# EAGLE schematic irkit_v02 (EAGLE 6.4)
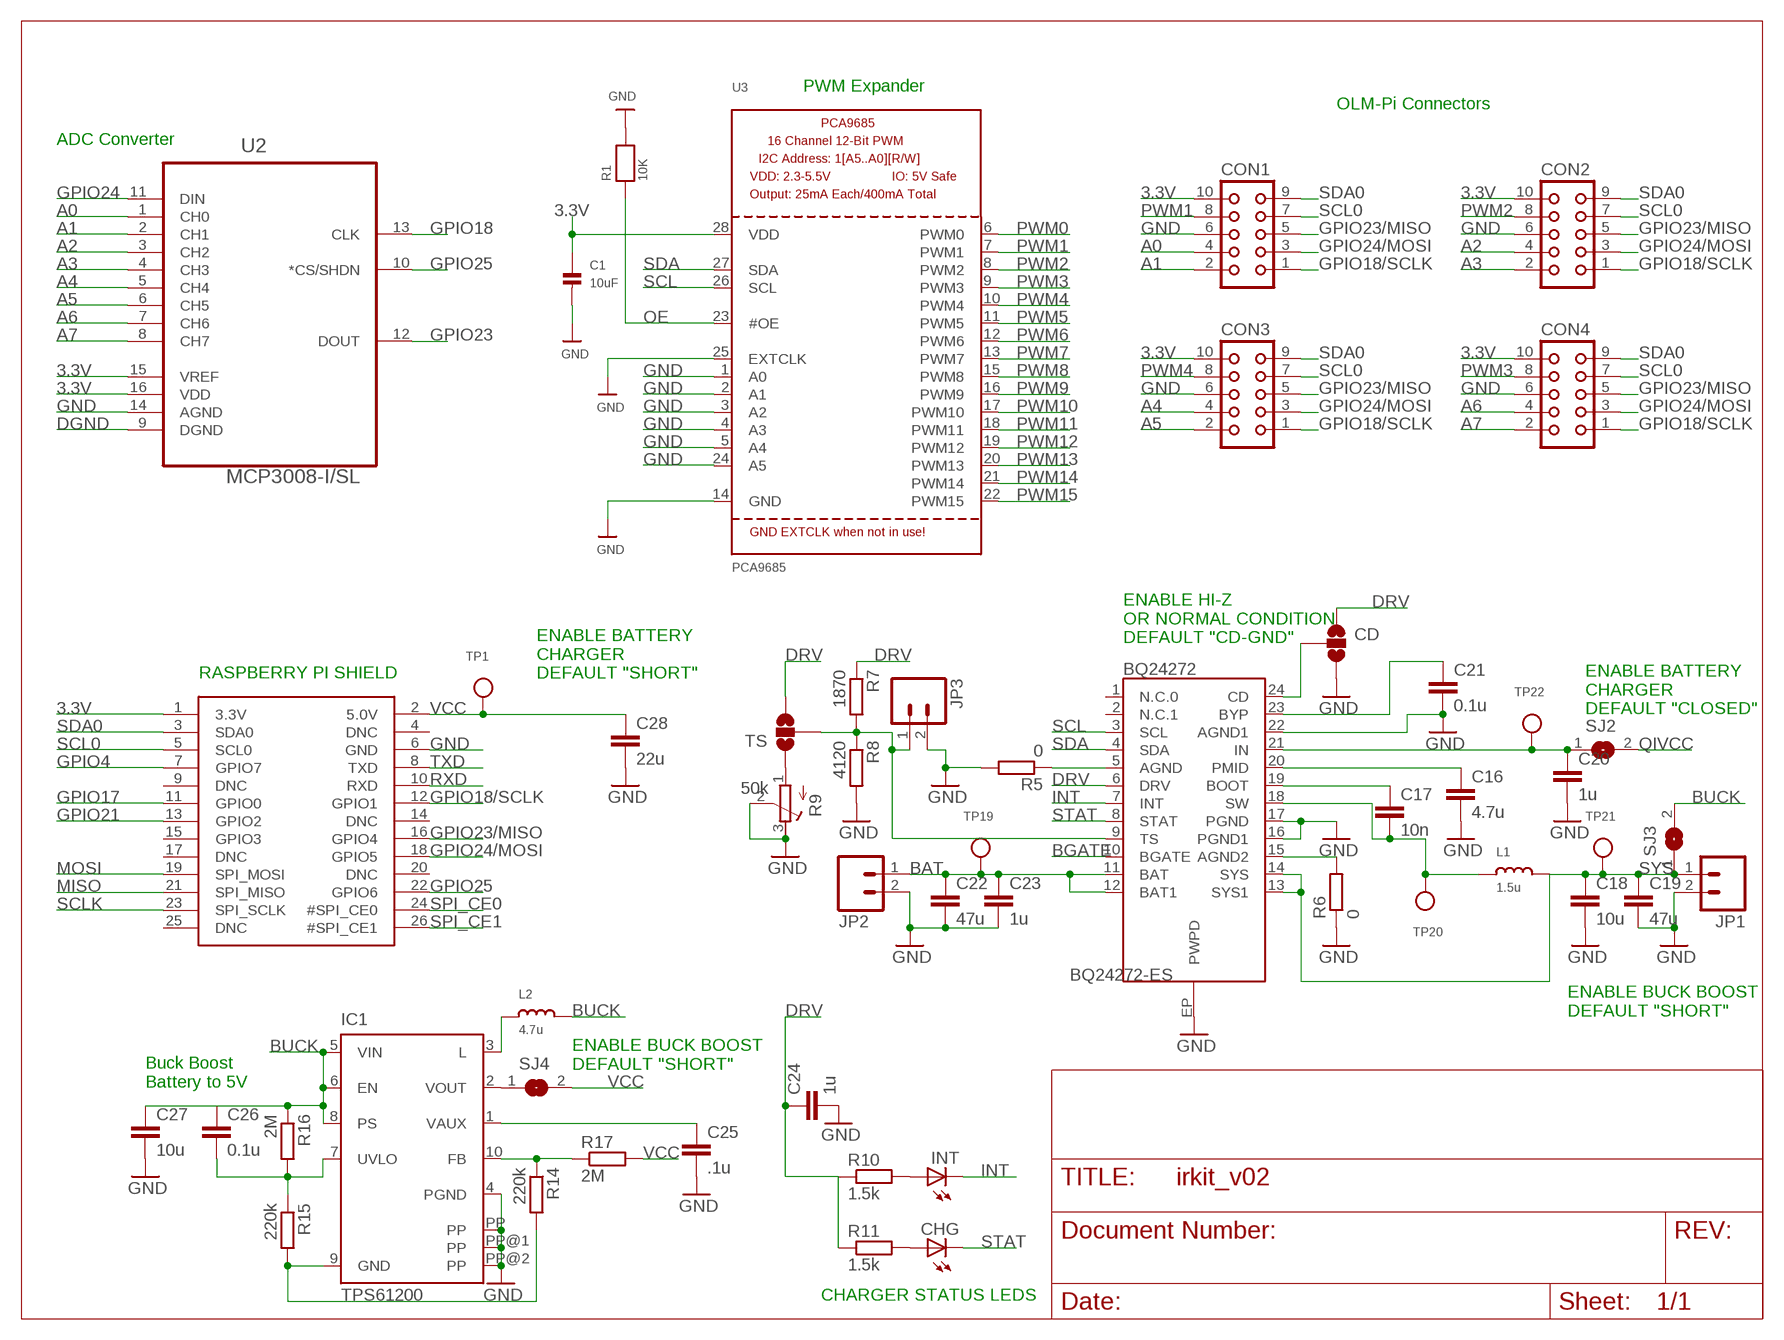
[diagram p0: schematic, sheet 1]

## Parts
BQ24272  BQ24272-ES  [QFN-24_ALT2]
C1  10uF  CAP_CERAMIC0805  [0805]
C16  4.7u  C-EUC0603K  [C0603K]
C17  10n  C-EUC0603K  [C0603K]
C18  10u  C-EUC0603K  [C0603K]
C19  47u  C-EUC0603K  [C0603K]
C20  1u  C-EUC0603K  [C0603K]
C21  0.1u  C-EUC0603K  [C0603K]
C22  47u  C-EUC0603K  [C0603K]
C23  1u  C-EUC0603K  [C0603K]
C24  1u  C-EUC0603K  [C0603K]
C25  .1u  C-EUC0603K  [C0603K]
C26  0.1u  C-EUC0603K  [C0603K]
C27  10u  C-EUC0603K  [C0603K]
C28  22u  C-EUC0603K  [C0603K]
CD  SOLDERJUMPER_2WAYS  [SJ_3]
CHG  LEDCHIP-LED0603  [CHIP-LED0603]
CON1  CON10L  [CON10L]
CON2  CON10L  [CON10L]
CON3  CON10L  [CON10L]
CON4  CON10L  [CON10L]
IC1  TPS61200  [S-PDSO-N10]
INT  LEDCHIP-LED0603  [CHIP-LED0603]
JP1  M02PTH3  [1X02_LONGPADS]
JP2  M02PTH3  [1X02_LONGPADS]
JP3  M02PTH3  [1X02_LONGPADS]
L1  1.5u  INDUCTORNR5040  [INDUCTOR_5X5MM_NR5040_NOTHERMALS]
L2  4.7u  INDUCTORNR5040  [INDUCTOR_5X5MM_NR5040_NOTHERMALS]
R1  10K  RESISTOR0805  [0805]
R5  0  R-EU_R0402  [R0402]
R6  0  R-EU_R0402  [R0402]
R7  1870  R-EU_R0402  [R0402]
R8  4120  R-EU_R0402  [R0402]
R9  50k  R-TRIMM64Y  [RTRIM64Y]
R10  1.5k  R-EU_R0402  [R0402]
R11  1.5k  R-EU_R0402  [R0402]
R14  220k  R-EU_R0402  [R0402]
R15  220k  R-EU_R0402  [R0402]
R16  2M  R-EU_R0402  [R0402]
R17  2M  R-EU_R0402  [R0402]
SJ2  SJ  [SJ]
SJ3  SJ  [SJ]
SJ4  SJ  [SJ]
TP1  TESTPOINTROUND1MM  [TESTPOINT_ROUND_1MM]
TP19  TESTPOINTROUND1MM  [TESTPOINT_ROUND_1MM]
TP20  TESTPOINTROUND1MM  [TESTPOINT_ROUND_1MM]
TP21  TESTPOINTROUND1MM  [TESTPOINT_ROUND_1MM]
TP22  TESTPOINTROUND1MM  [TESTPOINT_ROUND_1MM]
TS  SOLDERJUMPER_2WAYS  [SJ_3]
U2  MCP3008-I/SL  [SOIC127P600X175-16N]
U3  PCA9685  [TSSOP28]
U$1  RASPBERRYPI_BB  [RASBERRYPI_SHIELD]

## Nets
3.3V: C1.1 CON1.10 CON2.10 CON3.10 CON4.10 U2.15(VREF) U2.16(VDD) U3.28(VDD) U$1.1(3.3V)
A0: CON1.4 U2.1(CH0)
A1: CON1.2 U2.2(CH1)
A2: CON2.4 U2.3(CH2)
A3: CON2.2 U2.4(CH3)
A4: CON3.4 U2.5(CH4)
A5: CON3.2 U2.6(CH5)
A6: CON4.4 U2.7(CH6)
A7: CON4.2 U2.8(CH7)
BAT: BQ24272.11(BAT) BQ24272.12(BAT1) C22.1 C23.1 JP2.1 TP19.P$1
BGATE: BQ24272.10(BGATE)
BUCK: C26.1 C27.1 IC1.5(VIN) IC1.6(EN) IC1.8(PS) L2.P$2 R16.1 SJ3.2
DGND: U2.9(DGND)
DRV: BQ24272.6(DRV) C24.1 CD.1 R7.1 R10.1 R11.1 TS.3
GND: BQ24272.16(PGND1) BQ24272.17(PGND) BQ24272.22(AGND1) BQ24272.EP(PWPD) C1.2 C16.2 C18.2 C19.2 C20.2 C21.2 C22.2 C23.2 C24.2 C25.2 C27.2 C28.2 CD.3 CON1.6 CON2.6 CON3.6 CON4.6 IC1.4(PGND) IC1.PP IC1.PP@1(PP) IC1.PP@2(PP) JP1.2 JP2.2 JP3.2 R1.2 R5.2 R6.1 R8.2 R9.2(S) R9.3(E) U2.14(AGND) U3.1(A0) U3.2(A1) U3.3(A2) U3.4(A3) U3.5(A4) U3.14(GND) U3.24(A5) U3.25(EXTCLK) U$1.6(GND)
GPIO4: U$1.7(GPIO7)
GPIO17: U$1.11(GPIO0)
GPIO18: U2.13(CLK)
GPIO18/SCLK: CON1.1 CON2.1 CON3.1 CON4.1 U$1.12(GPIO1)
GPIO21: U$1.13(GPIO2)
GPIO23: U2.12(DOUT)
GPIO23/MISO: CON1.5 CON2.5 CON3.5 CON4.5 U$1.16(GPIO4)
GPIO24: U2.11(DIN)
GPIO24/MOSI: CON1.3 CON2.3 CON3.3 CON4.3 U$1.18(GPIO5)
GPIO25: U2.10(*CS/SHDN) U$1.22(GPIO6)
INT: BQ24272.7(INT) INT.C
MISO: U$1.21(SPI_MISO)
MOSI: U$1.19(SPI_MOSI)
N$2: BQ24272.5(AGND) R5.1
N$3: BQ24272.21(IN) C20.1 SJ2.1 TP22.P$1
N$4: R9.1(A) TS.1
N$5: BQ24272.20(PMID) C16.1
N$6: BQ24272.19(BOOT) C17.1
N$8: BQ24272.18(SW) C17.2 L1.P$1 TP20.P$1
N$9: BQ24272.23(BYP) C21.1
N$24: BQ24272.15(AGND2) R6.2
N$71: BQ24272.24(CD) CD.2
N$72: BQ24272.9(TS) JP3.1 R7.2 R8.1 TS.2
N$73: INT.A R10.2
N$74: CHG.A R11.2
N$148: C25.1 IC1.1(VAUX)
N$151: IC1.3(L) L2.P$1
N$152: IC1.10(FB) R14.1 R17.1
N$153: C26.2 IC1.7(UVLO) R15.1 R16.2
N$154: IC1.2(VOUT) SJ4.1
N$155: IC1.9(GND) R14.2 R15.2
OE: R1.1 U3.23(#OE)
PWM0: U3.6(PWM0)
PWM1: CON1.8 U3.7(PWM1)
PWM2: CON2.8 U3.8(PWM2)
PWM3: CON4.8 U3.9(PWM3)
PWM4: CON3.8 U3.10(PWM4)
PWM5: U3.11(PWM5)
PWM6: U3.12(PWM6)
PWM7: U3.13(PWM7)
PWM8: U3.15(PWM8)
PWM9: U3.16(PWM9)
PWM10: U3.17(PWM10)
PWM11: U3.18(PWM11)
PWM12: U3.19(PWM12)
PWM13: U3.20(PWM13)
PWM14: U3.21(PWM14)
PWM15: U3.22(PWM15)
QIVCC: SJ2.2
RXD: U$1.10(RXD)
SCL: BQ24272.3(SCL) U3.26(SCL)
SCL0: CON1.7 CON2.7 CON3.7 CON4.7 U$1.5(SCL0)
SCLK: U$1.23(SPI_SCLK)
SDA: BQ24272.4(SDA) U3.27(SDA)
SDA0: CON1.9 CON2.9 CON3.9 CON4.9 U$1.3(SDA0)
SPI_CE0: U$1.24(#SPI_CE0)
SPI_CE1: U$1.26(#SPI_CE1)
STAT: BQ24272.8(STAT) CHG.C
SYS: BQ24272.13(SYS1) BQ24272.14(SYS) C18.1 C19.1 JP1.1 L1.P$2 SJ3.1 TP21.P$1
TXD: U$1.8(TXD)
VCC: C28.1 R17.2 SJ4.2 TP1.P$1 U$1.2(5.0V)
Unconnected: BQ24272.1(N.C.0) BQ24272.2(N.C.1) U$1.4(DNC) U$1.9(DNC) U$1.14(DNC) U$1.15(GPIO3) U$1.17(DNC) U$1.20(DNC) U$1.25(DNC)

## Notes on the sheet
- PWM Expander
- OLM-Pi Connectors
- ADC Converter
- ENABLE HI-Z
  OR NORMAL CONDITION
  DEFAULT "CD-GND"
- RASPBERRY PI SHIELD
- ENABLE BATTERY
  CHARGER
  DEFAULT "SHORT"
- ENABLE BATTERY
  CHARGER
  DEFAULT "CLOSED"
- ENABLE BUCK BOOST
  DEFAULT "SHORT"
- ENABLE BUCK BOOST
  DEFAULT "SHORT"
- Buck Boost
  Battery to 5V
- CHARGER STATUS LEDS

## Library data of the parts
BQ24272 = chad1:BQ24272: Allegro A6282 16-Channel Constant-Current LED Driver Packages: TSSOP-24, 24-pin QFN Last modified: 8/20/10 Unproven!
C1 = microbuilder:CAP_CERAMIC: Ceramic Capacitors 0402 - 0402 Surface Mount Capacitors 16pF 50V 5% [Digikey: 445-4899-2-ND] 18pF 50V 5% [Digikey: 490-1281-2-ND] 22pF 50V 5% [Digikey: 490-1283-2-ND] 68pF 50V 5% [Digikey: 490-1289-2-ND] 0.1uF 10V 10% [Digikey: 490-1318-2-ND] 1.0uF 6.3V 10% [Digikey: 490-1320-2-ND] 0603 - 0603 Surface Mount Capacitors 16 pF 50V 5% [Digikey: 445-5051-2-ND] 22 pF 50V [Digikey: PCC220ACVTR-ND] 33 pF 50V 5% [Digikey: 490-1415-1-ND] 56pF 50V 5% [Digikey: 490-1421-1-ND] 220pF 50V 5% [Digikey: 445-1285-1-ND] 680 pF 50V 2200 pF 50V 5% C0G [Digikey: 445-1297-1-ND] 5600 pF 100V 5% X7R [Digikey: 478-3711-1-ND] 0.1 µF 25V 10% [Digikey: PCC2277TR-ND] 0.22 µF 16V 10% X7R [Digikey: 445-1318-1-ND] 1.0 µF 25V 10% [Digikey: 445-5146-2-ND] 0603 - RF Specific 3pF 250V +/-0.1pF RF [Digikey: 712-1347-1-ND] 18 pF 250V 5% [Digikey: 478-3505-1-ND or 712-1322-1-ND] 56 pF 250V 5% C0G RF [Digikey: 490-4867-1-ND] 68 pF 250V RF [Digikey: 490-4868-1-ND] 0805 - 0805 Surface Mount Capacitors 220 pF 250V 2% RF Ceramic Capacitor [Digikey: 712-1398-1-ND] 1000 pF 50V 2% NP0 Ceramic Capacitor [Digikey: 478-3760-1-ND] 0.1 µF 25V 10% Ceramic Capacitor [Digikey: PCC1828TR-ND] 1.0 µF 16V 10% Ceramic Capacitor[Digikey: 490-1691-2-ND] 10.0 µF 10V 10% Ceramic Capacitor[Digikey: 709-1228-1-ND] 10.0 uF 16V 10% Ceramic Capacitor [Digikey: 478-5165-2-ND] 47 uF 6.3V 20% Ceramic Capacitor [Digikey: 587-1779-1-ND or 399-5506-1-ND] 1206 - 1206 Surface Mount Capacitors 47uF 10V 20% Ceramic Capacitor [Digikey: 490-5528-1-ND or 399-5508-1-ND or 445-6010-1-ND] 100uF 6.3V -20%, +80% Y5V Ceramic Capacitor (Digikey: 490-4512-1-ND, Mouser: 81-GRM31CF50J107ZE1L)
C16-C28 = resistor:C-EU: CAPACITOR, European symbol; OC_NEWARK: unknown
CD TS = chad1:SOLDERJUMPER_2WAY: Solder Jumper 2 way solder jumper
CHG INT = led:LED: LED OSRAM: - CHIPLED LG R971, LG N971, LY N971, LG Q971, LY Q971, LO R971, LY R971 LH N974, LH R974 LS Q976, LO Q976, LY Q976 LO Q996 - Hyper CHIPLED LW Q18S LB Q993, LB Q99A, LB R99A - SideLED LS A670, LO A670, LY A670, LG A670, LP A670 LB A673, LV A673, LT A673, LW A673 LH A674 LY A675 LS A676, LA A676, LO A676, LY A676, LW A676 LS A679, LY A679, LG A679 - Hyper Micro SIDELED® LS Y876, LA Y876, LO Y876, LY Y876 LT Y87S - SmartLED LW L88C, LW L88S LB L89C, LB L89S, LG L890 LS L89K, LO L89K, LY L89K LS L896, LA L896, LO L896, LY L896 - TOPLED LS T670, LO T670, LY T670, LG T670, LP T670 LSG T670, LSP T670, LSY T670, LOP T670, LYG T670 LG T671, LOG T671, LSG T671 LB T673, LV T673, LT T673, LW T673 LH T674 LS T676, LA T676, LO T676, LY T676, LB T676, LH T676, LSB T676, LW T676 LB T67C, LV T67C, LT T67C, LS T67K, LO T67K, LY T67K, LW E67C LS E67B, LA E67B, LO E67B, LY E67B, LB E67C, LV E67C, LT E67C LW T67C LS T679, LY T679, LG T679 LS T770, LO T770, LY T770, LG T770, LP T770 LB T773, LV T773, LT T773, LW T773 LH T774 LS E675, LA E675, LY E675, LS T675 LS T776, LA T776, LO T776, LY T776, LB T776 LHGB T686 LT T68C, LB T68C - Hyper Mini TOPLED® LB M676 - Mini TOPLED Santana® LG M470 LS M47K, LO M47K, LY M47K Source: http://www.osram.convergy.de LUXEON: - LUMILED® LXK2-PW12-R00, LXK2-PW12-S00, LXK2-PW14-U00, LXK2-PW14-V00 LXK2-PM12-R00, LXK2-PM12-S00, LXK2-PM14-U00 LXK2-PE12-Q00, LXK2-PE12-R00, LXK2-PE12-S00, LXK2-PE14-T00, LXK2-PE14-U00 LXK2-PB12-K00, LXK2-PB12-L00, LXK2-PB12-M00, LXK2-PB14-N00, LXK2-PB14-P00, LXK2-PB14-Q00 LXK2-PR12-L00, LXK2-PR12-M00, LXK2-PR14-Q00, LXK2-PR14-R00 LXK2-PD12-Q00, LXK2-PD12-R00, LXK2-PD12-S00 LXK2-PH12-R00, LXK2-PH12-S00 LXK2-PL12-P00, LXK2-PL12-Q00, LXK2-PL12-R00 Source: www.luxeon.com KINGBRIGHT: KA-3528ASYC Source: www.kingbright.com
CON1-CON4 = con-harting:CON10L: CONNECTOR; OC_FARNELL: unknown; OC_NEWARK: unknown
IC1 = texas:TPS6120*: LOW INPUT VOLTAGE SYNCHRONOUS BOOST CONVERTER WITH 1.3-A SWITCHES Source: http://focus.ti.com/lit/ds/symlink/tps61200.pdf; MPN: TPS61200DRCT; OC_FARNELL: 1471238; OC_NEWARK: 37M0066
JP1-JP3 = chad1:M02: Header 2 Standard 2-pin 0.1" header. Use with straight break away headers (SKU : PRT-00116), right angle break away headers (PRT-00553), swiss pins (PRT-00743), machine pins (PRT-00117), and female headers (PRT-00115). Molex polarized connector foot print use with SKU : PRT-08233 with associated crimp pins and housings.
L1 L2 = microbuilder1:INDUCTOR: Inductors 0603: 10nH Ceramic Inductor - microwire antenna/RF (Digikey: 712-1434-2-ND) 0805: 560nH Ceramic Inductor - RF (Digikey: 553-1047-1-ND) 270nH Ceramic Inductor - Q = 40@250MHz, +-5%, 1 Ohm DC Resistance (Digikey: 535-10506-2-ND) 1007 (2518 Metric) SMT: 10µH 10% 250mOhm 820mA 1007 Inductor (Digikey: 587-2189-1-ND) 22µH 10% 500mOhm 580mA 1007 Inductor (Digikey: 587-2190-1-ND) 47µH 10% 950mOhm 420mA 1007 Inductor (Digikey: 587-2191-1-ND) 47µH 5% 100mOhm 1A 1008 Inductor (Digikey: 732-1816-1-ND) 5.0x5.0mm (Taiyo Yuden NR5040 Series) 6.8µH 20% 2.3A 64mOhm Inductor (Digikey: 587-2374-2-ND) 5.0x5.0mm (TDK VLC5045 Series) 4.7µH 20% 3.3A 34mOhm Inductor (Digikey: 445-6526-1-ND) 6.8µH 20% 2.7A 46mOhm Inductor (Digikey: 445-6527-1-ND) 6.0x6.0mm (TDK VLC6045 Series) 4.7µH 20% 3.8A 27mOhm Inductor (Digikey: 445-6538-2-ND) 6.8µH 20% 3A 41mOhm Inductor (Digikey: 445-6540-1-ND) 6.2µH 30% 2.2A 45mOhm Inductor (Digikey: SRR5028-6R2YCT-ND) - Not TDK VLC6045 but footprint should match 6.0x6.0mm (TDK SLF6045 Series) 6.8uH 30% 2A 33mOhm Inductor (Digikey: 445-4572-1-ND, Mouser: 810-SLF645T6R8N2R0PF)
R1 = microbuilder:RESISTOR: Resistors 0402 - 0402 Surface Mount Package 22 Ohm 1% 1/16W [Digikey: 311-22.0LRTR-ND] 33 Ohm 5% 1/16W 1.0K 5% 1/16W 1.5K 5% 1/16W 2.0K 1% 1/16W 10.0K 1% 1/16W [Digikey: 311-10.0KLRTR-ND] 10.0K 5% 1/16W [Digikey: RMCF0402JT10K0TR-ND] 12.1K 1% 1/16W [Digikey: 311-22.0LRTR-ND] 100.0K 5% 1/16W 0603 - 0603 Surface Mount Package 0 Ohm 1/10 Watt 1% Resistor 15 Ohm 1/10 Watt 1% Resistor 33 Ohm 1/10 Watt 1% Resistor 49.9 Ohm 1/10 Watt 1% Resistor 100 Ohm 1/10 Watt 1% Resistor 150 Ohm 1/10 Watt 1% Resistor 240 Ohm 1/10 Watt 1% Resistor 390 Ohm 1/10 Watt 1% Resistor 560 Ohm 1/10 Watt 1% Resistor 680 Ohm 1/10 Watt 1% Resistor 750 Ohm 1/10 Watt 1% Resistor 1.0K Ohm 1/10 Watt 1% Resistor 1.5K Ohm 1/10 Watt 1% Resistor 2.0K Ohm 1/10 Watt 1% Resistor 2.2K Ohm 1/10 Watt 1% Resistor 3.3K Ohm 1/10 Watt 1% Resistor 4.7K Ohm 1/10 Watt 1% Resistor 10.0K Ohm 1/10 Watt 1% Resistor 12.0K Ohm 1/10 Watt 1% Resistor 12.1K Ohm 1/10 Watt 1% Resistor 20.0K Ohm 1/10 Watt 1% Resistor 33.0K Ohm 1/10 Watt 1% Resistor 100.0K Ohm 1/10 Watt 1% Resistor 0805 - 0805 Surface Mount Package 0 Ohm 1/8 Watt 1% Resistor 33 Ohm 1/8 Watt 1% Resistor 100 Ohm 1/8 Watt 1% Resistor 150 Ohm 1/8 Watt 1% Resistor 200 Ohm 1/8 Watt 1% Resistor 240 Ohm 1/8 Watt 1% Resistor 330 Ohm 1/8 Watt 1% Resistor 390 Ohm 1/8 Watt 1% Resistor 470 Ohm 1/8 Watt 1% Resistor 1.0K Ohm 1/8 Watt 1% Resistor 1.5K Ohm 1/8 Watt 1% Resistor 2.0K Ohm 1/8 Watt 1% Resistor 4.7K Ohm 1/8 Watt 1% Resistor 5.1K Ohm 1/8 Watt 1% Resistor 5.6K Ohm 1/8 Watt 1% Resistor 10.0K Ohm 1/8 Watt 1% Resistor 22.0K Ohm 1/8 Watt 1% Resistor 33.0K Ohm 1/8 Watt 1% Resistor 100K Ohm 1/8 Watt 1% Resistor 1206 - 1206 Surface Mount Package 2012 - 2010 Surface Mount Package 0.11 Ohm 1/2 Watt 1% Resistor - Digikey: RHM.11UCT-ND
R5-R8 R10 R11 R14-R17 = resistor:R-EU_: RESISTOR, European symbol; MPN: ERJ3EKF3000V; OC_NEWARK: 65T8414
R9 = rcl:R-TRIMM: Trimm resistor
SJ2-SJ4 = jumper:SJ: SMD solder JUMPER
TP1 TP19-TP22 = microbuilder:TESTPOINT: Test Point Various test points for characterisation and PCB testing TESTPOINT_SMT - Compact Surface Mount Test Point [Digikey: 5016KTR-ND]
U2 = Ava:MCP3008-I/SL: 10BIT ADC, 8 CH, SPI, SMD; MPN: MCP3008-I/SL; OC_FARNELL: 1292241; OC_NEWARK: 19C7201; PACKAGE: SOIC16; SUPPLIER: Microchip
U3 = microbuilder:PCA9685: PCA9685 - 16 Channel 12-Bit I2C PWM Controller 5.0V tolerant 16 channel, 12-bit I2C PWM controller with 25mA per output (max. 400mA total) Digikey: 568-5931-1-ND
U$1 = microbuilder1:RASPBERRYPI_B

## Net classes
1 power: width 0.813 mm, clearance 0.203 mm